# Altium schematic sheet ToF_Sensor_Hub.SchDoc: 4x IR ToF Sensor Hub
size A4; DrawnBy: Samyar Sadat Akhavi; Revision: 1.0; SheetNumber: 1; SheetTotal: 2
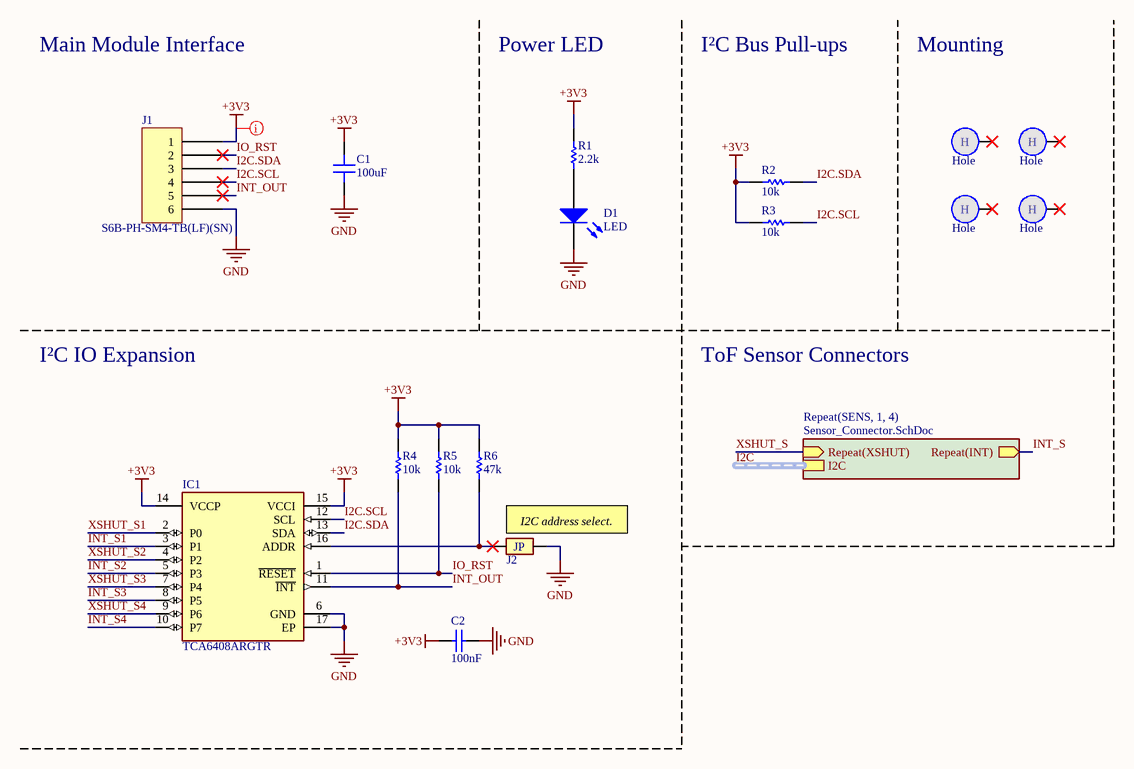
[diagram p0: ToF_Sensor_Hub.SchDoc]

## Parts
?  (no value)  (graphical)
C1  100uF  [MURATA CAP GRM31C 1206_3216]
C2  100nF  [CAP_SMD_603]
D1  LED  [LED 0805_2012 RED]
Hole1  Hole  [Hole_2mm]  (no BOM)
Hole2  Hole  [Hole_2mm]  (no BOM)
Hole3  Hole  [Hole_2mm]  (no BOM)
Hole4  Hole  [Hole_2mm]  (no BOM)
IC1  TCA6408ARGTR  [QFN50P300X300X100-17N-D]
J1  S6B-PH-SM4-TB(LF)(SN)  [JST S6B-PH-SM4-TB]
J2  Jumper Pad  [Jumper Pad]  (value not drawn)  (no BOM)
R1  2.2k  [RES_0603]
R2  10k  [RES_0603]
R3  10k  [RES_0603]
R4  10k  [RES_0603]
R5  10k  [RES_0603]
R6  47k  [RES_0603]

## Sub-sheets
Repeat(SENS, 1, 4) = Sensor_Connector.SchDoc: I2C (harness I2C), Repeat(XSHUT) (in), Repeat(INT) (out)

## Nets
+3V3: C1.2 C2.2 IC1.14(VCCP) IC1.15(VCCI) J1.1 R1.1 R2.1 R3.1 R4.2 R5.2 R6.2
GND: C1.1 C2.1 D1.2(K) IC1.6(GND) IC1.17(EP) J1.6 J2.2
I2C.SCL: IC1.12(SCL) J1.4 R3.2
I2C.SDA: IC1.13(SDA) J1.3 R2.2
INT_OUT: IC1.11(~{INT}) J1.5 R4.1
INT_S: sheet Repeat(SENS, 1, 4)/Repeat(INT)
INT_S1: IC1.3(P1)
INT_S2: IC1.5(P3)
INT_S3: IC1.8(P5)
INT_S4: IC1.10(P7)
IO_RST: IC1.1(~{RESET}) J1.2 R5.1
XSHUT_S: sheet Repeat(SENS, 1, 4)/Repeat(XSHUT)
XSHUT_S1: IC1.2(P0)
XSHUT_S2: IC1.4(P2)
XSHUT_S3: IC1.7(P4)
XSHUT_S4: IC1.9(P6)
NetD1_1: D1.1(A) R1.2
NetIC1_16: IC1.16(ADDR) J2.1 R6.1

Not connected (* = marked no-connect by the designer): Hole1 1*; Hole2 1*; Hole3 1*; Hole4 1*

## Buses and harness runs
harness I2C = sheet Repeat(SENS, 1, 4)/I2C

## Layout directives
rule Supply Nets [Voltage = 3.300]: +3V3

## Notes on the sheet
- Main Module Interface
- Power LED
- I²C Bus Pull-ups
- Mounting
- I²C IO Expansion
- ToF Sensor Connectors
- (near J2) I2C address select.
- Sub-Project:
- Size:
- Drawn By:
- Revision:
- Date:
- File:
- Sheet:
- of
- (in symbol Hole) H
- (in symbol Jumper Pad) JP

## Library data of the parts
? = Standard Title Block
C1 = GRM31CR60J107KEA8L: CAP CER 100UF 6.3V X5R 1206; manufacturer: Murata Electronics; Tolerance: ±10%; Part Number: GRM31CR60J107KEA8L; Applications: General Purpose; componentlink1description: Datasheet; componentlink1url: https://search.murata.co.jp/Ceramy/image/img/A01X/G101/ENG/GRM31CR60J107KEA8-01A.pdf; componentlink2description: DigiKey Link; componentlink2url: https://www.digikey.com/en/products/detail/murata-electronics/GRM31CR60J107KEA8L/16286000; Device Package: 1206 (3216 Metric); lastupdated: 7/27/2025 6:13:50 AM; Lifecycle Status: Active; Minimum Order: 1; Mounting Type: Surface Mount, MLCC; Operating Temperature: -55°C ~ 85°C; Package / Case: 1206 (3216 Metric); packaging: TapeAndReel; partid: 42924; Part Status: Active; price: 0.10; series: GRM; Size / Dimension: 0.126" L x 0.063" W (3.20mm x 1.60mm); Supplier 1: DigiKey; Supplier Part Number 1: 490-GRM31CR60J107KEA8LCT-ND; Temperature Coefficient: X5R; Thickness (Max): 0.075" (1.90mm); value: 100uF; Voltage - Rated: 6.3V
C2 = Non-polar Capacitor: Generic Ceramic Capacitor; Voltage: 6.3V; Value: 100nF
D1 = LED: Indicator LED; Color: Red
IC1 = TCA6408ARGTR: Integrated Circuit; Manufacturer_Name: Texas Instruments; Datasheet Link: https://www.ti.com/lit/ds/symlink/tca6408a.pdf?HQS=dis-dk-null-digikeymode-dsf-pf-null-wwe&ts=1650414321322&ref_url=https%253A%252F%252Fwww.ti.com%252Fgeneral%252Fdocs%252Fsuppproductinfo.tsp%253FdistId%253D10%2526gotoUrl%253Dhttps%253A%252F%252Fwww.ti.co; Height: 1mm; Manufacturer_Part_Number: TCA6408ARGTR; Mouser Part Number: 595-TCA6408ARGTR; Mouser Price/Stock: https://www.mouser.co.uk/ProductDetail/Texas-Instruments/TCA6408ARGTR?qs=I4smPnw5um2xBJN3iV2JIg%3D%3D; Arrow Part Number: TCA6408ARGTR; Arrow Price/Stock: https://www.arrow.com/en/products/tca6408argtr/texas-instruments?region=nac
J1 = S6B-PH-SM4-TB(LF)(SN): CONN HEADER SMD R/A 6POS 2MM; Manufacturer: JST Sales America Inc.; Contact Length - Mating: 0.130" (3.30mm); Current Rating (Amps): 2A; Material Flammability Rating: UL94 V-0; Number of Positions: 6; Number of Positions Loaded: All; Pitch - Mating: 0.079" (2.00mm); Shrouding: Shrouded - 4 Wall; Style: Board to Cable/Wire; Voltage Rating: 100V; Part Number: S6B-PH-SM4-TB(LF)(SN); ComponentLink1Description: Datasheet; ComponentLink1URL: http://www.jst-mfg.com/product/pdf/eng/ePH.pdf; ComponentLink2Description: DigiKey Link; ComponentLink2URL: http://digikey.com/product-detail/en/jst-sales-america-inc/S6B-PH-SM4-TB-LF-SN/455-1753-1-ND/926850; Connector Type: Header; Contact Finish - Mating: Tin; Contact Finish - Post: Tin; Contact Material: Copper Alloy; Contact Shape: Square; Contact Type: Male Pin; Fastening Type: Detent Lock; Features: Solder Retention; Insulation Color: Natural; Insulation Height: 0.217" (5.51mm); Insulation Material: Polyamide (PA6T), Nylon 6T; LastUpdated: 1/15/2020 3:38:11 AM; Lifecycle Status: Active; Minimum Order: 1; Mounting Type: Surface Mount, Right Angle; Number of Rows: 1; Operating Temperature: -25°C ~ 85°C; Packaging: TapeAndReel; PartId: 112; Part Status: Active; Price: 0.45; Series: PH; Supplier 1: DigiKey; Supplier Part Number 1: 455-1753-1-ND; Termination: Solder
R1-R6 = Resistor: Generic Resistor; Power: 1/8W
  R1: Value: 2.2k
  R2-R5: Value: 10k
  R6: Value: 47k